# Altium project PIC_Prototyping_PCB.PrjPcb
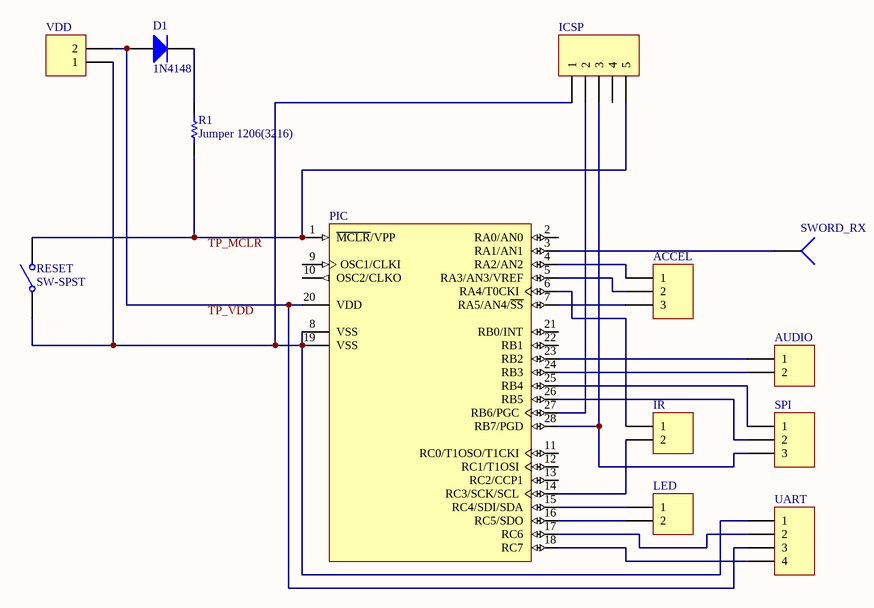
[diagram p0: PIC_Prototyping_Schematic.SchDoc]
1 sheet, 13 parts. Net scope: global (net labels, ports and power ports of the same name join across sheets).
Board file: PIC_Prototyping_PCB.PcbDoc

## Sheet PIC_Prototyping_Schematic.SchDoc
size A

### Parts
ACCEL  Header 3  [HDR1X3]  (value not drawn)
AUDIO  Header 2  [HDR1X2]  (value not drawn)
D1  1N4148  [DO-35]
ICSP  Header 5  [HDR1X5]  (value not drawn)
IR  Header 2  [HDR1X2]  (value not drawn)
LED  Header 2  [HDR1X2]  (value not drawn)
PIC  PIC16F72-I/SP  [SPDIP300-SP28]  (value not drawn)
R1  Jumper 1206(3216)  [RESC1206(3216)_L]
RESET  SW-SPST  [SPST-2]
SPI  Header 3  [HDR1X3]  (value not drawn)
SWORD_RX  Socket  [PIN1]  (value not drawn)
UART  Header 4  [HDR1X4]  (value not drawn)
VDD  Header 2  [HDR1X2]  (value not drawn)

### Nets
NetACCEL_1: ACCEL.1 PIC.4(RA2/AN2)
NetACCEL_2: ACCEL.2 PIC.5(RA3/AN3/VREF)
NetACCEL_3: ACCEL.3 PIC.7(RA5/AN4/~{SS})
NetAUDIO_1: AUDIO.1 PIC.23(RB2)
NetAUDIO_2: AUDIO.2 PIC.24(RB3)
NetD1_1: D1.1(A) PIC.20(VDD) UART.3 VDD.2
NetD1_2: D1.2(K) R1.2
NetICSP_1: ICSP.1 PIC.8(VSS) PIC.19(VSS) RESET.1(COMMON) UART.1 VDD.1
NetICSP_2: ICSP.2 PIC.27(RB6/PGC)
NetICSP_3: ICSP.3 PIC.28(RB7/PGD) SPI.3
NetICSP_5: ICSP.5 PIC.1(~{MCLR}/VPP) R1.1 RESET.2(NO)
NetIR_1: IR.1 PIC.6(RA4/T0CKI)
NetIR_2: IR.2 PIC.14(RC3/SCK/SCL)
NetLED_1: LED.1 PIC.15(RC4/SDI/SDA)
NetLED_2: LED.2 PIC.16(RC5/SDO)
NetPIC_3: PIC.3(RA1/AN1) SWORD_RX.1
NetPIC_17: PIC.17(RC6) UART.2
NetPIC_18: PIC.18(RC7) UART.4
NetPIC_25: PIC.25(RB4) SPI.1
NetPIC_26: PIC.26(RB5) SPI.2

Not connected (* = marked no-connect by the designer): ICSP 4; PIC 2(RA0/AN0) 9(OSC1/CLKI) 10(OSC2/CLKO) 11(RC0/T1OSO/T1CKI) 12(RC1/T1OSI) 13(RC2/CCP1) 21(RB0/INT) 22(RB1)

### Notes on the sheet
- Labels drawn without touching a wire or pin: TP_MCLR, TP_VDD

### Library data of the parts
ACCEL SPI = Header 3: Header, 3-Pin; LatestRevisionDate: 17-Jul-2002; LatestRevisionNote: Re-released for DXP Platform.; Publisher: Altium Limited
AUDIO IR LED VDD = Header 2: Header, 2-Pin; LatestRevisionDate: 17-Jul-2002; LatestRevisionNote: Re-released for DXP Platform.; Publisher: Altium Limited
D1 = 1N4148: High Conductance Fast Diode; Published: 8-Jun-2000; LatestRevisionDate: 17-Jul-2002; LatestRevisionNote: Re-released for DXP Platform.; DatasheetDocument: 1997; PackageReference: DO-35; Publisher: Altium Limited; Code_JEDEC: DO-204-AH; ComponentLink1Description: Manufacturer Link; ComponentLink1URL: http://www.fairchildsemi.com/; ComponentLink2Description: Datasheet; ComponentLink2URL: http://www.fairchildsemi.com/ds/1N%2F1N4148.pdf
ICSP = Header 5: Header, 5-Pin; LatestRevisionDate: 17-Jul-2002; LatestRevisionNote: Re-released for DXP Platform.; Publisher: Altium Limited
PIC = PIC16F72-I/SP: 8-Bit CMOS FLASH Microcontroller with A/D Converter, 2K (x14-Bit words) FLASH, 128 Bytes RAM, 28-Pin PDIP 300mil, Standard VDD Range, Industrial Temperature; Published: 11-Oct-2004; LatestRevisionDate: 29-Jan-2009; LatestRevisionNote: Sch. layout revised. 3D Model Removed.; DatasheetVersion: revC, Jan-2007; PackageVersion: revBB, Aug-2009; PackageReference: SPDIP300-SP28; Publisher: Altium Limited; PackageDescription: 28-Lead Skinny Plastic Dual In-Line (SP) - 300 mil Body [SPDIP]; Supplier 1: Digi-Key; Supplier Part Number 1: PIC16F72-I/SP-ND; Supplier 2: Farnell; Supplier Part Number 2: 9760636; ComponentLink1Description: Datasheet; ComponentLink1URL: http://ww1.microchip.com/downloads/en/DeviceDoc/39597C.pdf; ComponentLink2Description: Packaging Specification; ComponentLink2URL: http://www.microchip.com/stellent/groups/techpub_sg/documents/packagingspec/en012702.pdf; ComponentLink3Description: Microchip.com Home; ComponentLink3URL: http://www.microchip.com/
R1 = CMP-1014-00001-1: Jumper 1206 (3216 Metric); Tolerance: None; Case-EIA: 1206; Case-Metric: 3216; Value: 0.00 Ohm; Technology: SMT; Power: None
RESET = SW-SPST: Single-Pole, Single-Throw Switch; Published: 24-Mar-1999; LatestRevisionDate: 17-Jul-2002; LatestRevisionNote: Re-released for DXP Platform.; PackageReference: SPST-2; Publisher: Altium Limited; PackageDescription: Switch; 2 Leads
UART = Header 4: Header, 4-Pin; LatestRevisionDate: 17-Jul-2002; LatestRevisionNote: Re-released for DXP Platform.; Publisher: Altium Limited
SWORD_RX = Socket: LatestRevisionDate: 17-Jul-2002; LatestRevisionNote: Re-released for DXP Platform.; Publisher: Altium Limited